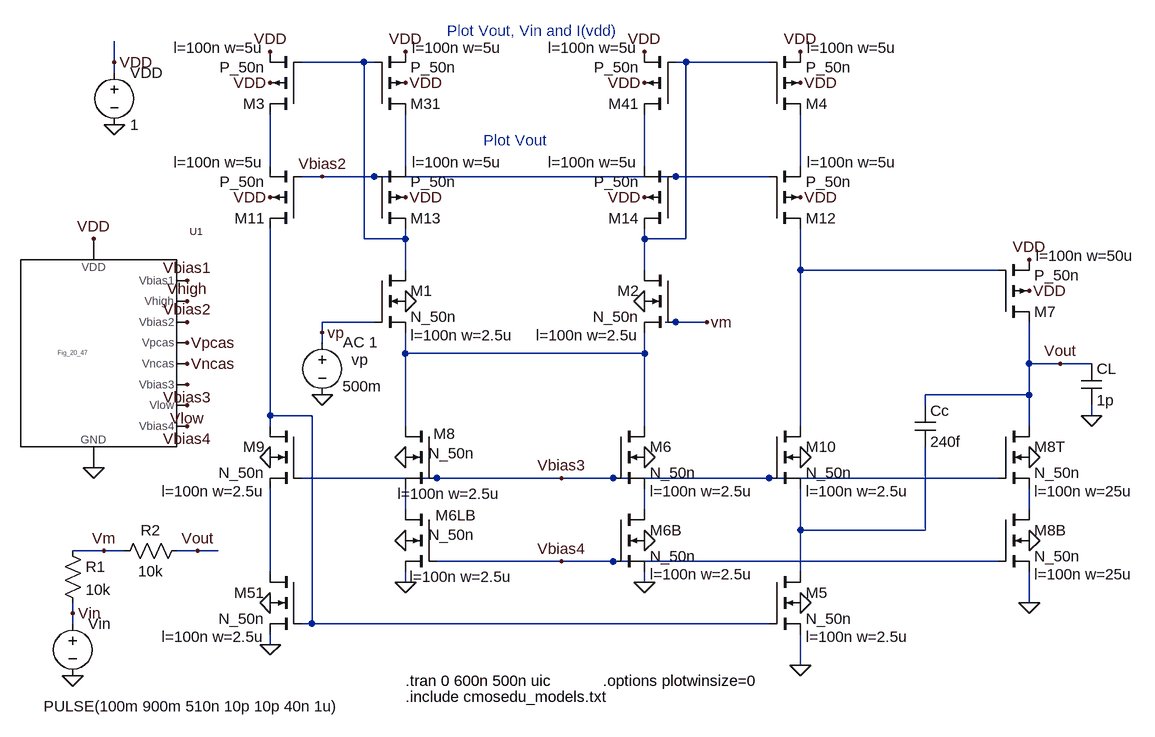
[diagram p0: schematic Fig24_39.asc]
Fig24_39.asc, the LTspice schematic file:
Version 4
SHEET 1 2732 680
WIRE 1136 -960 1136 -992
WIRE 1520 -960 1424 -960
WIRE 1536 -960 1520 -960
WIRE 2016 -960 2000 -960
WIRE 2144 -960 2016 -960
WIRE 1136 -944 1136 -960
WIRE 1376 -800 1376 -880
WIRE 1584 -800 1584 -880
WIRE 1952 -800 1952 -880
WIRE 2192 -800 2192 -880
WIRE 1456 -784 1424 -784
WIRE 1536 -784 1456 -784
WIRE 2000 -784 1536 -784
WIRE 2144 -784 2000 -784
WIRE 1520 -688 1520 -960
WIRE 1584 -688 1584 -704
WIRE 1584 -688 1520 -688
WIRE 1952 -688 1952 -704
WIRE 2016 -688 2016 -960
WIRE 2016 -688 1952 -688
WIRE 1584 -640 1584 -688
WIRE 1952 -640 1952 -688
WIRE 2192 -640 2192 -704
WIRE 2496 -640 2192 -640
WIRE 1536 -560 1456 -560
WIRE 2000 -560 1984 -560
WIRE 2048 -560 2000 -560
WIRE 1456 -544 1456 -560
WIRE 1456 -528 1456 -544
WIRE 1584 -512 1584 -544
WIRE 1952 -512 1952 -544
WIRE 1952 -512 1584 -512
WIRE 2544 -496 2544 -560
WIRE 2592 -496 2544 -496
WIRE 2640 -496 2592 -496
WIRE 2544 -448 2544 -496
WIRE 2544 -448 2384 -448
WIRE 2384 -432 2384 -448
WIRE 1376 -416 1376 -704
WIRE 1440 -416 1376 -416
WIRE 2640 -416 2640 -432
WIRE 1376 -400 1376 -416
WIRE 1584 -400 1584 -512
WIRE 1952 -400 1952 -512
WIRE 2192 -400 2192 -640
WIRE 2544 -400 2544 -448
WIRE 1632 -320 1424 -320
WIRE 1824 -320 1632 -320
WIRE 1904 -320 1824 -320
WIRE 2144 -320 1904 -320
WIRE 2496 -320 2144 -320
WIRE 1584 -272 1584 -304
WIRE 1952 -272 1952 -304
WIRE 2544 -272 2544 -304
WIRE 2192 -240 2192 -304
WIRE 2384 -240 2384 -368
WIRE 2384 -240 2192 -240
WIRE 1120 -208 1072 -208
WIRE 1152 -208 1120 -208
WIRE 1264 -208 1232 -208
WIRE 1296 -208 1264 -208
WIRE 1824 -192 1632 -192
WIRE 1904 -192 1824 -192
WIRE 2496 -192 1904 -192
WIRE 1376 -176 1376 -304
WIRE 2192 -176 2192 -240
WIRE 1584 -160 1584 -176
WIRE 1952 -160 1952 -176
WIRE 2544 -128 2544 -176
WIRE 1072 -112 1072 -128
WIRE 1072 -96 1072 -112
WIRE 1440 -96 1440 -416
WIRE 1440 -96 1424 -96
WIRE 2144 -96 1440 -96
WIRE 1376 -64 1376 -80
WIRE 2192 -32 2192 -80
FLAG 1136 -864 0
FLAG 1136 -960 VDD
FLAG 1952 -592 0
FLAG 1952 -160 0
FLAG 1584 -592 0
FLAG 1376 -928 VDD
FLAG 1104 -688 VDD
FLAG 1104 -336 0
FLAG 1248 -624 Vbias1
FLAG 1248 -592 Vhigh
FLAG 1248 -560 Vbias2
FLAG 1248 -464 Vbias3
FLAG 1248 -528 Vpcas
FLAG 1248 -496 Vncas
FLAG 1248 -400 Vbias4
FLAG 1248 -432 Vlow
FLAG 1376 -976 VDD
FLAG 1952 -224 0
FLAG 1456 -448 0
FLAG 2048 -560 vm
FLAG 1456 -544 vp
FLAG 1376 -64 0
FLAG 2192 -928 VDD
FLAG 2192 -32 0
FLAG 2192 -976 VDD
FLAG 2592 -496 Vout
FLAG 2640 -416 0
FLAG 1584 -928 VDD
FLAG 1584 -976 VDD
FLAG 1952 -976 VDD
FLAG 1952 -928 VDD
FLAG 1952 -352 0
FLAG 1584 -160 0
FLAG 1584 -224 0
FLAG 1584 -352 0
FLAG 1824 -320 Vbias3
FLAG 1824 -192 Vbias4
FLAG 1376 -352 0
FLAG 1376 -128 0
FLAG 2192 -128 0
FLAG 2192 -352 0
FLAG 1376 -752 VDD
FLAG 2192 -752 VDD
FLAG 1584 -752 VDD
FLAG 1952 -752 VDD
FLAG 1456 -784 Vbias2
FLAG 2544 -608 VDD
FLAG 2544 -656 VDD
FLAG 2544 -128 0
FLAG 2544 -224 0
FLAG 2544 -352 0
FLAG 1072 -16 0
FLAG 1264 -208 Vout
FLAG 1120 -208 Vm
FLAG 1072 -112 Vin
SYMBOL voltage 1136 -960 R0
WINDOW 123 0 0 Left 2
WINDOW 39 0 0 Left 2
SYMATTR InstName VDD
SYMATTR Value 1
SYMBOL nmos4 2000 -640 M0
WINDOW 123 56 100 Left 2
SYMATTR Value2 l=100n w=2.5u
SYMATTR InstName M2
SYMATTR Value N_50n
SYMBOL nmos4 1536 -640 R0
WINDOW 123 56 100 Left 2
SYMATTR Value2 l=100n w=2.5u
SYMATTR InstName M1
SYMATTR Value N_50n
SYMBOL pmos4 1424 -880 R180
WINDOW 123 58 102 Left 2
WINDOW 0 56 16 Left 2
SYMATTR Value2 l=100n w=5u
SYMATTR InstName M3
SYMATTR Value P_50n
SYMBOL Fig_20_47 1104 -512 R0
SYMATTR InstName U1
SYMBOL nmos4 1904 -272 R0
WINDOW 123 56 100 Left 2
SYMATTR Value2 l=100n w=2.5u
SYMATTR InstName M6B
SYMATTR Value N_50n
SYMBOL voltage 1456 -544 R0
WINDOW 0 45 42 Left 2
WINDOW 3 31 83 Left 2
WINDOW 39 0 0 Left 2
WINDOW 123 32 15 Left 2
SYMATTR InstName vp
SYMATTR Value 500m
SYMATTR Value2 AC 1
SYMBOL nmos4 1424 -176 M0
WINDOW 123 56 100 Left 2
SYMATTR Value2 l=100n w=2.5u
SYMATTR InstName M51
SYMATTR Value N_50n
SYMBOL pmos4 2144 -880 M180
WINDOW 123 58 102 Left 2
WINDOW 0 56 16 Left 2
SYMATTR Value2 l=100n w=5u
SYMATTR InstName M4
SYMATTR Value P_50n
SYMBOL nmos4 2144 -176 R0
WINDOW 123 56 100 Left 2
SYMATTR Value2 l=100n w=2.5u
SYMATTR InstName M5
SYMATTR Value N_50n
SYMBOL cap 2624 -496 R0
SYMATTR InstName CL
SYMATTR Value 1p
SYMBOL pmos4 1536 -880 M180
WINDOW 123 58 102 Left 2
WINDOW 0 56 16 Left 2
SYMATTR Value2 l=100n w=5u
SYMATTR InstName M31
SYMATTR Value P_50n
SYMBOL pmos4 2000 -880 R180
WINDOW 123 58 102 Left 2
WINDOW 0 56 16 Left 2
SYMATTR Value2 l=100n w=5u
SYMATTR InstName M41
SYMATTR Value P_50n
SYMBOL nmos4 1904 -400 R0
WINDOW 123 56 100 Left 2
SYMATTR Value2 l=100n w=2.5u
SYMATTR InstName M6
SYMATTR Value N_50n
SYMBOL nmos4 1632 -272 M0
WINDOW 123 -117 104 Left 2
WINDOW 0 -61 9 Left 2
WINDOW 3 -59 39 Left 2
SYMATTR Value2 l=100n w=2.5u
SYMATTR InstName M6LB
SYMATTR Value N_50n
SYMBOL nmos4 1632 -400 M0
WINDOW 123 -99 104 Left 2
WINDOW 0 -29 12 Left 2
WINDOW 3 -59 42 Left 2
SYMATTR Value2 l=100n w=2.5u
SYMATTR InstName M8
SYMATTR Value N_50n
SYMBOL nmos4 1424 -400 M0
WINDOW 123 56 100 Left 2
SYMATTR Value2 l=100n w=2.5u
SYMATTR InstName M9
SYMATTR Value N_50n
SYMBOL nmos4 2144 -400 R0
WINDOW 123 56 100 Left 2
SYMATTR Value2 l=100n w=2.5u
SYMATTR InstName M10
SYMATTR Value N_50n
SYMBOL pmos4 1424 -704 R180
WINDOW 123 58 102 Left 2
WINDOW 0 56 16 Left 2
SYMATTR Value2 l=100n w=5u
SYMATTR InstName M11
SYMATTR Value P_50n
SYMBOL pmos4 2144 -704 M180
WINDOW 123 58 102 Left 2
WINDOW 0 56 16 Left 2
SYMATTR Value2 l=100n w=5u
SYMATTR InstName M12
SYMATTR Value P_50n
SYMBOL pmos4 1536 -704 M180
WINDOW 123 58 102 Left 2
WINDOW 0 56 16 Left 2
SYMATTR Value2 l=100n w=5u
SYMATTR InstName M13
SYMATTR Value P_50n
SYMBOL pmos4 2000 -704 R180
WINDOW 123 58 102 Left 2
WINDOW 0 56 16 Left 2
SYMATTR Value2 l=100n w=5u
SYMATTR InstName M14
SYMATTR Value P_50n
SYMBOL pmos4 2496 -560 M180
WINDOW 123 58 102 Left 2
WINDOW 0 56 16 Left 2
SYMATTR Value2 l=100n w=50u
SYMATTR InstName M7
SYMATTR Value P_50n
SYMBOL nmos4 2496 -272 R0
WINDOW 123 56 100 Left 2
SYMATTR Value2 l=100n w=25u
SYMATTR InstName M8B
SYMATTR Value N_50n
SYMBOL nmos4 2496 -400 R0
WINDOW 123 56 100 Left 2
SYMATTR Value2 l=100n w=25u
SYMATTR InstName M8T
SYMATTR Value N_50n
SYMBOL cap 2368 -432 R0
SYMATTR InstName Cc
SYMATTR Value 240f
SYMBOL voltage 1072 -112 R0
WINDOW 3 -45 143 Left 2
WINDOW 123 0 0 Left 2
WINDOW 39 0 0 Left 2
SYMATTR Value PULSE(100m 900m 510n 10p 10p 40n 1u)
SYMATTR InstName Vin
SYMBOL res 1056 -224 R0
SYMATTR InstName R1
SYMATTR Value 10k
SYMBOL res 1136 -192 R270
WINDOW 0 32 56 VTop 2
WINDOW 3 0 56 VBottom 2
SYMATTR InstName R2
SYMATTR Value 10k
TEXT 1584 16 Left 2 !.include cmosedu_models.txt
TEXT 1648 -1008 Left 2 ;Plot Vout, Vin and I(vdd)
TEXT 1584 -8 Left 2 !.tran 0 600n 500n uic
TEXT 1704 -840 Left 2 ;Plot Vout
TEXT 1888 -8 Left 2 !.options plotwinsize=0

The netlist it stands for:
* Fig24_39.asc
VDD VDD 0 1
M2 N002 vm N008 0 N_50n l=100n w=2.5u
M1 N001 vp N008 0 N_50n l=100n w=2.5u
M3 N003 N001 VDD VDD P_50n l=100n w=5u
XU1 Vbias1 Vhigh Vbias2 Vpcas Vncas Vbias3 Vlow Vbias4 VDD 0 Fig_20_47  ; pins Vbias1 Vhigh Vbias2 Vpcas Vncas Vbias3 Vlow Vbias4 VDD GND
M6B N011 Vbias4 0 0 N_50n l=100n w=2.5u
vp vp 0 500m AC 1
M51 N014 N009 0 0 N_50n l=100n w=2.5u
M4 N006 N002 VDD VDD P_50n l=100n w=5u
M5 N013 N009 0 0 N_50n l=100n w=2.5u
CL Vout 0 1p
M31 N004 N001 VDD VDD P_50n l=100n w=5u
M41 N005 N002 VDD VDD P_50n l=100n w=5u
M6 N008 Vbias3 N011 0 N_50n l=100n w=2.5u
M6LB N010 Vbias4 0 0 N_50n l=100n w=2.5u
M8 N008 Vbias3 N010 0 N_50n l=100n w=2.5u
M9 N009 Vbias3 N014 0 N_50n l=100n w=2.5u
M10 N007 Vbias3 N013 0 N_50n l=100n w=2.5u
M11 N009 Vbias2 N003 VDD P_50n l=100n w=5u
M12 N007 Vbias2 N006 VDD P_50n l=100n w=5u
M13 N001 Vbias2 N004 VDD P_50n l=100n w=5u
M14 N002 Vbias2 N005 VDD P_50n l=100n w=5u
M7 Vout N007 VDD VDD P_50n l=100n w=50u
M8B N012 Vbias4 0 0 N_50n l=100n w=25u
M8T Vout Vbias3 N012 0 N_50n l=100n w=25u
Cc Vout N013 240f
Vin Vin 0 PULSE(100m 900m 510n 10p 10p 40n 1u)
R1 vm Vin 10k
R2 vm Vout 10k
.model NMOS NMOS
.model PMOS PMOS
.lib standard.mos
.include cmosedu_models.txt
* Plot Vout, Vin and I(vdd)
.tran 0 600n 500n uic
* Plot Vout
.options plotwinsize=0
.backanno
.end